# Altium schematic sheet APP_1_FPGA_m.SchDoc
size Tabloid; SheetNumber: 5; SheetTotal: 16; Sheet_Name: FPGA_m; Size: 11x17
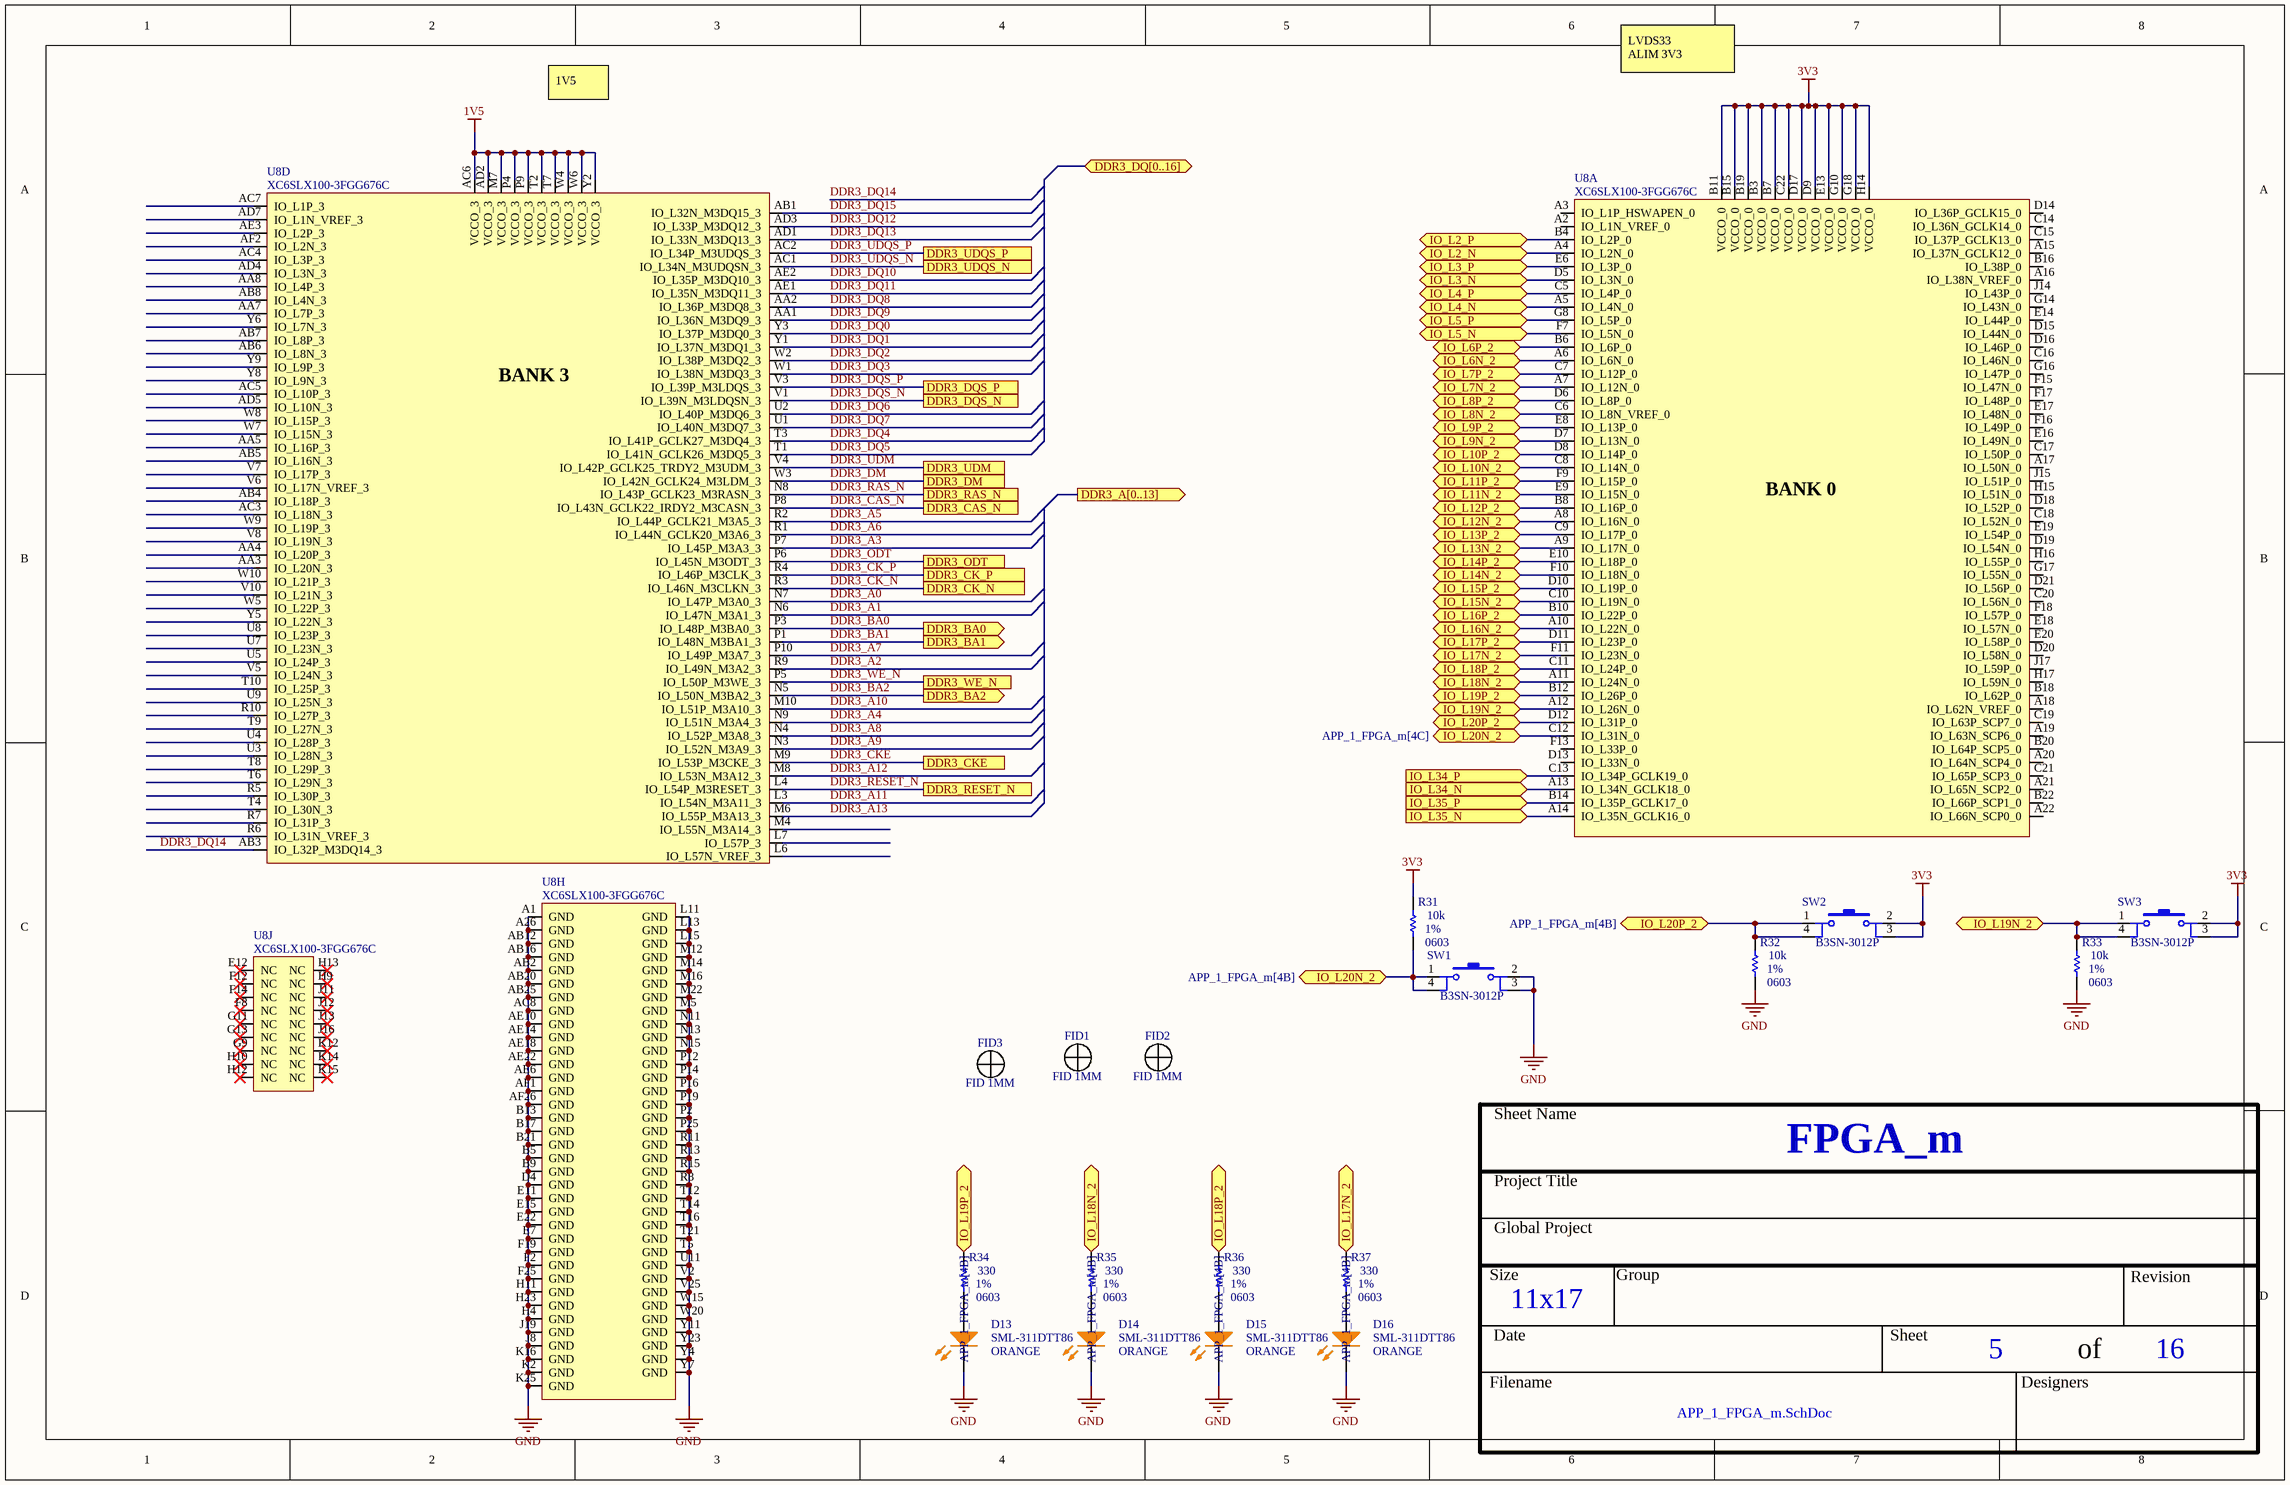
[diagram p0: APP_1_FPGA_m.SchDoc]

## Parts
D13  SML-311DTT86  value ORANGE  [LED_0603]
D14  SML-311DTT86  value ORANGE  [LED_0603]
D15  SML-311DTT86  value ORANGE  [LED_0603]
D16  SML-311DTT86  value ORANGE  [LED_0603]
FID1  FID 1MM  [FID_CIRCLE_1MM]
FID2  FID 1MM  [FID_CIRCLE_1MM]
FID3  FID 1MM  [FID_CIRCLE_1MM]
R31  value 10k  Package: 0603  Precision: 1%  [RES_0603]  (hidden comment: RES - 0603)
R32  value 10k  Package: 0603  Precision: 1%  [RES_0603]  (hidden comment: RES - 0603)
R33  value 10k  Package: 0603  Precision: 1%  [RES_0603]  (hidden comment: RES - 0603)
R34  value 330  Package: 0603  Precision: 1%  [RES_0603]  (hidden comment: RES - 0603)
R35  value 330  Package: 0603  Precision: 1%  [RES_0603]  (hidden comment: RES - 0603)
R36  value 330  Package: 0603  Precision: 1%  [RES_0603]  (hidden comment: RES - 0603)
R37  value 330  Package: 0603  Precision: 1%  [RES_0603]  (hidden comment: RES - 0603)
SW1  B3SN-3012P  [SWI_TACT_B3SN-3012P]
SW2  B3SN-3012P  [SWI_TACT_B3SN-3012P]
SW3  B3SN-3012P  [SWI_TACT_B3SN-3012P]
U8  XC6SLX100-3FGG676C  [FPGA_XILINX_FGG676]  (parts A,D,H,J of 10)

## Ports
DDR3_A[0..13] (out, see APP_1_DDR3_m[1B]), DDR3_BA0 (out, see APP_1_DDR3_m[2C]), DDR3_BA1 (out, see APP_1_DDR3_m[2C]), DDR3_BA2 (out, see APP_1_DDR3_m[2C]), DDR3_CAS_N (see APP_1_DDR3_m[2C]), DDR3_CK_N (see APP_1_DDR3_m[1C]), DDR3_CK_P (see APP_1_DDR3_m[1C]), DDR3_CKE, DDR3_DM, DDR3_DQ[0..16] (bidir, see APP_1_DDR3_m[4B]), DDR3_DQS_N, DDR3_DQS_P, DDR3_ODT (see APP_1_DDR3_m[2C]), DDR3_RAS_N (see APP_1_DDR3_m[2C]), DDR3_RESET_N, DDR3_UDM (see APP_1_DDR3_m[4C]), DDR3_UDQS_N (see APP_1_DDR3_m[4C]), DDR3_UDQS_P (see APP_1_DDR3_m[4C]), DDR3_WE_N (see APP_1_DDR3_m[2C]), IO_L2_N (bidir), IO_L2_P (bidir), IO_L3_N (bidir), IO_L3_P (bidir), IO_L4_N (bidir), IO_L4_P (bidir), IO_L5_N (bidir), IO_L5_P (bidir), IO_L6N_2 (bidir), IO_L6P_2 (bidir), IO_L7N_2 (bidir), IO_L7P_2 (bidir), IO_L8N_2 (bidir), IO_L8P_2 (bidir), IO_L9N_2 (bidir), IO_L9P_2 (bidir), IO_L10N_2 (bidir), IO_L10P_2 (bidir), IO_L11N_2 (bidir), IO_L11P_2 (bidir), IO_L12N_2 (bidir), IO_L12P_2 (bidir), IO_L13N_2 (bidir), IO_L13P_2 (bidir), IO_L14N_2 (bidir), IO_L14P_2 (bidir), IO_L15N_2 (bidir), IO_L15P_2 (bidir), IO_L16N_2 (bidir), IO_L16P_2 (bidir), IO_L17N_2 (bidir), IO_L17N_2 (bidir, see APP_1_FPGA_m[4B]), IO_L17P_2 (bidir), IO_L18N_2 (bidir), IO_L18N_2 (bidir, see APP_1_FPGA_m[4B]), IO_L18P_2 (bidir), IO_L18P_2 (bidir, see APP_1_FPGA_m[4B]), IO_L19N_2 (bidir), IO_L19P_2 (bidir), IO_L19P_2 (bidir, see APP_1_FPGA_m[4B]), IO_L20N_2 (bidir, see APP_1_FPGA_m[4B]), IO_L20N_2 (bidir, see APP_1_FPGA_m[4C]), IO_L20P_2 (bidir), IO_L20P_2 (bidir, see APP_1_FPGA_m[4B]), IO_L34_N (in), IO_L34_P (in), IO_L35_N (in), IO_L35_P (in)

## Nets
1V5: U8.AC6(VCCO_3) U8.AD2(VCCO_3) U8.M7(VCCO_3) U8.P4(VCCO_3) U8.P9(VCCO_3) U8.T2(VCCO_3) U8.T7(VCCO_3) U8.W4(VCCO_3) U8.W6(VCCO_3) U8.Y2(VCCO_3)
3V3: R31.2 SW2.2 SW2.3 SW3.2 SW3.3 U8.B3(VCCO_0) U8.B7(VCCO_0) U8.B11(VCCO_0) U8.B15(VCCO_0) U8.B19(VCCO_0) U8.C22(VCCO_0) U8.D9(VCCO_0) U8.D17(VCCO_0) U8.E13(VCCO_0) U8.G10(VCCO_0) U8.G18(VCCO_0) U8.H14(VCCO_0)
GND: D13.K D14.K D15.K D16.K R32.1 R33.1 SW1.2 SW1.3 U8.A1(GND) U8.A26(GND) U8.AB2(GND) U8.AB12(GND) U8.AB16(GND) U8.AB20(GND) U8.AB25(GND) U8.AC8(GND) U8.AE6(GND) U8.AE10(GND) U8.AE14(GND) U8.AE18(GND) U8.AE22(GND) U8.AF1(GND) U8.AF26(GND) U8.B5(GND) U8.B9(GND) U8.B13(GND) U8.B17(GND) U8.B21(GND) U8.D4(GND) U8.E7(GND) U8.E11(GND) U8.E15(GND) U8.E22(GND) U8.F2(GND) U8.F19(GND) U8.F25(GND) U8.H4(GND) U8.H11(GND) U8.H23(GND) U8.J8(GND) U8.J19(GND) U8.K2(GND) U8.K16(GND) U8.K25(GND) U8.L11(GND) U8.L13(GND) U8.L15(GND) U8.M5(GND) U8.M12(GND) U8.M14(GND) U8.M16(GND) U8.M22(GND) U8.N11(GND) U8.N13(GND) U8.N15(GND) U8.P2(GND) U8.P12(GND) U8.P14(GND) U8.P16(GND) U8.P19(GND) U8.P25(GND) U8.R8(GND) U8.R11(GND) U8.R13(GND) U8.R15(GND) U8.T5(GND) U8.T12(GND) U8.T14(GND) U8.T16(GND) U8.T21(GND) U8.U11(GND) U8.V2(GND) U8.V25(GND) U8.W15(GND) U8.W20(GND) U8.Y4(GND) U8.Y7(GND) U8.Y11(GND) U8.Y23(GND)
DDR3_A0: U8.N7(IO_L47P_M3A0_3)
DDR3_A1: U8.N6(IO_L47N_M3A1_3)
DDR3_A2: U8.R9(IO_L49N_M3A2_3)
DDR3_A3: U8.P7(IO_L45P_M3A3_3)
DDR3_A4: U8.N9(IO_L51N_M3A4_3)
DDR3_A5: U8.R2(IO_L44P_GCLK21_M3A5_3)
DDR3_A6: U8.R1(IO_L44N_GCLK20_M3A6_3)
DDR3_A7: U8.P10(IO_L49P_M3A7_3)
DDR3_A8: U8.N4(IO_L52P_M3A8_3)
DDR3_A9: U8.N3(IO_L52N_M3A9_3)
DDR3_A10: U8.M10(IO_L51P_M3A10_3)
DDR3_A11: U8.L3(IO_L54N_M3A11_3)
DDR3_A12: U8.M8(IO_L53N_M3A12_3)
DDR3_A13: U8.M6(IO_L55P_M3A13_3)
DDR3_BA0: U8.P3(IO_L48P_M3BA0_3) ; port DDR3_BA0
DDR3_BA1: U8.P1(IO_L48N_M3BA1_3) ; port DDR3_BA1
DDR3_BA2: U8.N5(IO_L50N_M3BA2_3) ; port DDR3_BA2
DDR3_CAS_N: U8.P8(IO_L43N_GCLK22_IRDY2_M3CASN_3) ; port DDR3_CAS_N
DDR3_CK_N: U8.R3(IO_L46N_M3CLKN_3) ; port DDR3_CK_N
DDR3_CK_P: U8.R4(IO_L46P_M3CLK_3) ; port DDR3_CK_P
DDR3_CKE: U8.M9(IO_L53P_M3CKE_3) ; port DDR3_CKE
DDR3_DM: U8.W3(IO_L42N_GCLK24_M3LDM_3) ; port DDR3_DM
DDR3_DQ0: U8.Y3(IO_L37P_M3DQ0_3)
DDR3_DQ1: U8.Y1(IO_L37N_M3DQ1_3)
DDR3_DQ2: U8.W2(IO_L38P_M3DQ2_3)
DDR3_DQ3: U8.W1(IO_L38N_M3DQ3_3)
DDR3_DQ4: U8.T3(IO_L41P_GCLK27_M3DQ4_3)
DDR3_DQ5: U8.T1(IO_L41N_GCLK26_M3DQ5_3)
DDR3_DQ6: U8.U2(IO_L40P_M3DQ6_3)
DDR3_DQ7: U8.U1(IO_L40N_M3DQ7_3)
DDR3_DQ8: U8.AA2(IO_L36P_M3DQ8_3)
DDR3_DQ9: U8.AA1(IO_L36N_M3DQ9_3)
DDR3_DQ10: U8.AE2(IO_L35P_M3DQ10_3)
DDR3_DQ11: U8.AE1(IO_L35N_M3DQ11_3)
DDR3_DQ12: U8.AD3(IO_L33P_M3DQ12_3)
DDR3_DQ13: U8.AD1(IO_L33N_M3DQ13_3)
DDR3_DQ14: U8.AB3(IO_L32P_M3DQ14_3)
DDR3_DQ15: U8.AB1(IO_L32N_M3DQ15_3)
DDR3_DQS_N: U8.V1(IO_L39N_M3LDQSN_3) ; port DDR3_DQS_N
DDR3_DQS_P: U8.V3(IO_L39P_M3LDQS_3) ; port DDR3_DQS_P
DDR3_ODT: U8.P6(IO_L45N_M3ODT_3) ; port DDR3_ODT
DDR3_RAS_N: U8.N8(IO_L43P_GCLK23_M3RASN_3) ; port DDR3_RAS_N
DDR3_RESET_N: U8.L4(IO_L54P_M3RESET_3) ; port DDR3_RESET_N
DDR3_UDM: U8.V4(IO_L42P_GCLK25_TRDY2_M3UDM_3) ; port DDR3_UDM
DDR3_UDQS_N: U8.AC1(IO_L34N_M3UDQSN_3) ; port DDR3_UDQS_N
DDR3_UDQS_P: U8.AC2(IO_L34P_M3UDQS_3) ; port DDR3_UDQS_P
DDR3_WE_N: U8.P5(IO_L50P_M3WE_3) ; port DDR3_WE_N
IO_L2_N: U8.A4(IO_L2N_0) ; port IO_L2_N
IO_L2_P: U8.B4(IO_L2P_0) ; port IO_L2_P
IO_L3_N: U8.D5(IO_L3N_0) ; port IO_L3_N
IO_L3_P: U8.E6(IO_L3P_0) ; port IO_L3_P
IO_L4_N: U8.A5(IO_L4N_0) ; port IO_L4_N
IO_L4_P: U8.C5(IO_L4P_0) ; port IO_L4_P
IO_L5_N: U8.F7(IO_L5N_0) ; port IO_L5_N
IO_L5_P: U8.G8(IO_L5P_0) ; port IO_L5_P
IO_L6N_2: U8.A6(IO_L6N_0) ; port IO_L6N_2
IO_L6P_2: U8.B6(IO_L6P_0) ; port IO_L6P_2
IO_L7N_2: U8.A7(IO_L12N_0) ; port IO_L7N_2
IO_L7P_2: U8.C7(IO_L12P_0) ; port IO_L7P_2
IO_L8N_2: U8.C6(IO_L8N_VREF_0) ; port IO_L8N_2
IO_L8P_2: U8.D6(IO_L8P_0) ; port IO_L8P_2
IO_L9N_2: U8.D7(IO_L13N_0) ; port IO_L9N_2
IO_L9P_2: U8.E8(IO_L13P_0) ; port IO_L9P_2
IO_L10N_2: U8.C8(IO_L14N_0) ; port IO_L10N_2
IO_L10P_2: U8.D8(IO_L14P_0) ; port IO_L10P_2
IO_L11N_2: U8.E9(IO_L15N_0) ; port IO_L11N_2
IO_L11P_2: U8.F9(IO_L15P_0) ; port IO_L11P_2
IO_L12N_2: U8.A8(IO_L16N_0) ; port IO_L12N_2
IO_L12P_2: U8.B8(IO_L16P_0) ; port IO_L12P_2
IO_L13N_2: U8.A9(IO_L17N_0) ; port IO_L13N_2
IO_L13P_2: U8.C9(IO_L17P_0) ; port IO_L13P_2
IO_L14N_2: U8.F10(IO_L18N_0) ; port IO_L14N_2
IO_L14P_2: U8.E10(IO_L18P_0) ; port IO_L14P_2
IO_L15N_2: U8.C10(IO_L19N_0) ; port IO_L15N_2
IO_L15P_2: U8.D10(IO_L19P_0) ; port IO_L15P_2
IO_L16N_2: U8.A10(IO_L22N_0) ; port IO_L16N_2
IO_L16P_2: U8.B10(IO_L22P_0) ; port IO_L16P_2
IO_L17N_2: R37.2 U8.F11(IO_L23N_0) ; port IO_L17N_2
IO_L17P_2: U8.D11(IO_L23P_0) ; port IO_L17P_2
IO_L18N_2: R35.2 U8.A11(IO_L24N_0) ; port IO_L18N_2
IO_L18P_2: R36.2 U8.C11(IO_L24P_0) ; port IO_L18P_2
IO_L19N_2: R33.2 SW3.1 SW3.4 U8.A12(IO_L26N_0) ; port IO_L19N_2
IO_L19P_2: R34.2 U8.B12(IO_L26P_0) ; port IO_L19P_2
IO_L20N_2: R31.1 SW1.1 SW1.4 U8.C12(IO_L31N_0) ; port IO_L20N_2
IO_L20P_2: R32.2 SW2.1 SW2.4 U8.D12(IO_L31P_0) ; port IO_L20P_2
IO_L34_N: U8.A13(IO_L34N_GCLK18_0) ; port IO_L34_N
IO_L34_P: U8.C13(IO_L34P_GCLK19_0) ; port IO_L34_P
IO_L35_N: U8.A14(IO_L35N_GCLK16_0) ; port IO_L35_N
IO_L35_P: U8.B14(IO_L35P_GCLK17_0) ; port IO_L35_P
NetD13_A: D13.A R34.1
NetD14_A: D14.A R35.1
NetD15_A: D15.A R36.1
NetD16_A: D16.A R37.1

Not connected (* = marked no-connect by the designer): FID1 1 2; FID2 1 2; FID3 1 2; U8 A2(IO_L1N_VREF_0) A3(IO_L1P_HSWAPEN_0) A15(IO_L37N_GCLK12_0) A16(IO_L38N_VREF_0) A17(IO_L50N_0) A18(IO_L62N_VREF_0) A19(IO_L63N_SCP6_0) A20(IO_L64N_SCP4_0) A21(IO_L65N_SCP2_0) A22(IO_L66N_SCP0_0) AA3(IO_L20N_3) AA4(IO_L20P_3) AA5(IO_L16P_3) AA7(IO_L7P_3) AA8(IO_L4P_3) AB4(IO_L18P_3) AB5(IO_L16N_3) AB6(IO_L8N_3) AB7(IO_L8P_3) AB8(IO_L4N_3) AC3(IO_L18N_3) AC4(IO_L3P_3) AC5(IO_L10P_3) AC7(IO_L1P_3) AD4(IO_L3N_3) AD5(IO_L10N_3) AD7(IO_L1N_VREF_3) AE3(IO_L2P_3) AF2(IO_L2N_3) B16(IO_L38P_0) B18(IO_L62P_0) B20(IO_L64P_SCP5_0) B22(IO_L66P_SCP1_0) C14(IO_L36N_GCLK14_0) C15(IO_L37P_GCLK13_0) C16(IO_L46N_0) C17(IO_L50P_0) C18(IO_L52N_0) C19(IO_L63P_SCP7_0) C20(IO_L56N_0) C21(IO_L65P_SCP3_0) D13(IO_L33N_0) D14(IO_L36P_GCLK15_0) D15(IO_L44N_0) D16(IO_L46P_0) D18(IO_L52P_0) D19(IO_L54N_0) D20(IO_L58N_0) D21(IO_L56P_0) E12(NC)* E14(IO_L44P_0) E16(IO_L49N_0) E17(IO_L48N_0) E18(IO_L57N_0) E19(IO_L54P_0) E20(IO_L58P_0) F8(NC)* F12(NC)* F13(IO_L33P_0) F14(NC)* F15(IO_L47N_0) F16(IO_L49P_0) F17(IO_L48P_0) F18(IO_L57P_0) G9(NC)* G11(NC)* G13(NC)* G14(IO_L43N_0) G16(IO_L47P_0) G17(IO_L55N_0) H9(NC)* H10(NC)* H12(NC)* H13(NC)* H15(IO_L51N_0) H16(IO_L55P_0) H17(IO_L59N_0) J11(NC)* J12(NC)* J13(NC)* J14(IO_L43P_0) J15(IO_L51P_0) J16(NC)* J17(IO_L59P_0) K12(NC)* K14(NC)* K15(NC)* L6(IO_L57N_VREF_3) L7(IO_L57P_3) M4(IO_L55N_M3A14_3) R5(IO_L30P_3) R6(IO_L31N_VREF_3) R7(IO_L31P_3) R10(IO_L27P_3) T4(IO_L30N_3) T6(IO_L29N_3) T8(IO_L29P_3) T9(IO_L27N_3) T10(IO_L25P_3) U3(IO_L28N_3) U4(IO_L28P_3) U5(IO_L24P_3) U7(IO_L23N_3) U8(IO_L23P_3) U9(IO_L25N_3) V5(IO_L24N_3) V6(IO_L17N_VREF_3) V7(IO_L17P_3) V8(IO_L19N_3) V10(IO_L21N_3) W5(IO_L22P_3) W7(IO_L15N_3) W8(IO_L15P_3) W9(IO_L19P_3) W10(IO_L21P_3) Y5(IO_L22N_3) Y6(IO_L7N_3) Y8(IO_L9N_3) Y9(IO_L9P_3)

## Notes on the sheet
- 1V5
- LVDS33
  ALIM 3V3
- Sheet Name
- Project Title
- Global Project
- Size
- Group
- Revision
- Date
- Sheet
- of
- Filename
- Designers
- (in symbol FPGA_XC6SLX100-3FGG676C, part A) BANK 0
- (in symbol FPGA_XC6SLX100-3FGG676C, part D) BANK 3

## Library data of the parts
D13-D16 = LED_SML-311DTT86: LED - 611nM ORANGE 2mA - 0603; Voltage: 1.8V; Mfg: ROHM Semiconductor; Power: 44mW; Current: 2mA; HelpURL: http://media.digikey.com/pdf/Data%20Sheets/Rohm%20PDFs/SML-311%20Series.pdf; CreatedBy: Jonathan Bouchard; Temperature: -40°C to 85°C; Package: 0603; Precision: *; Mfg Part Number: SML-311DTT86; Supplier 1: Digikey; Supplier Part Number 1: 511-1303-1-ND
FID1-FID3 = FID_CIRCLE_1MM: FID - FIDUCIAL 1MM CIRCLE DOUBLE-SIDED - 1MM; GRAMS Lib Spec: 2.8; Magnetic Material: NO; Cryo: UNKNOWN; Value: *; Tolerance: *; Voltage Rating: *; Current Rating: *; Power Max: *; HelpURL: https://www.pcb-3d.com/wordpress/wp-content/uploads/ipc-sm-782a_amendment_1_and_2.pdf; CreatedBy/Date: Jonathan Bouchard 2018-07-23; VerifiedBy: Caroline Paulin - 25 juillet 2018; Temperature: *; Package: 1MM CIRCLE; Manufacturer #1: *; Manufacturer #2: *; Note: *; Assembly Type: NONE; Part Number #2: *; Part Number #1: *; Polarized: *; Supplier 1: *; Supplier Part Number 1: *
SW1-SW3 = SWI_TACT_B3SN-3012P: SWI - TACT SPST-NO 0.05A 24V - 4-SMD; Current: 50mA; Mfg: Omron; Mfg Part Number: B3SN-3012P; HelpURL: http://www.omron.com/ecb/products/pdf/en-b3sn.pdf; CreatedBy: Jonathan Bouchard; Temperature: -25°C ~ 70°C; Power: *; Precision: *; Package: 4-SMD; Value: *; Voltage: 24V; Supplier 1: Digikey; Supplier Part Number 1: SW261CT-ND
U8 = FPGA_XC6SLX100-3FGG676C: FPGA - XILINX SPARTAN 6 480 I/O - BGA-676; Voltage: 1.14 V ~ 1.26 V; Current: *; Power: *; Mfg: Xilinx; Mfg Part Number: XC6SLX100-3FGG676C; HelpURL: https://www.xilinx.com/support/documentation/data_sheets/ds162.pdf; CreatedBy: Jonathan Bouchard; Temperature: 0°C ~ 85°C (TJ); Value: *; Precision: *; Package: BGA-676; Supplier 1: Digikey; Supplier Part Number 1: 122-1760-ND
R31-R37 = RES - 0603: Current: *; CreatedBy: Jonathan Bouchard